# EasyEDA schematic SCH_抬升电路.json
TITLE: 抬升电路; REV: 1.0; Date: 2022-10-15; Sheet: 1/1; Drawn By: Banzhuan3721; Company: 垃圾桶
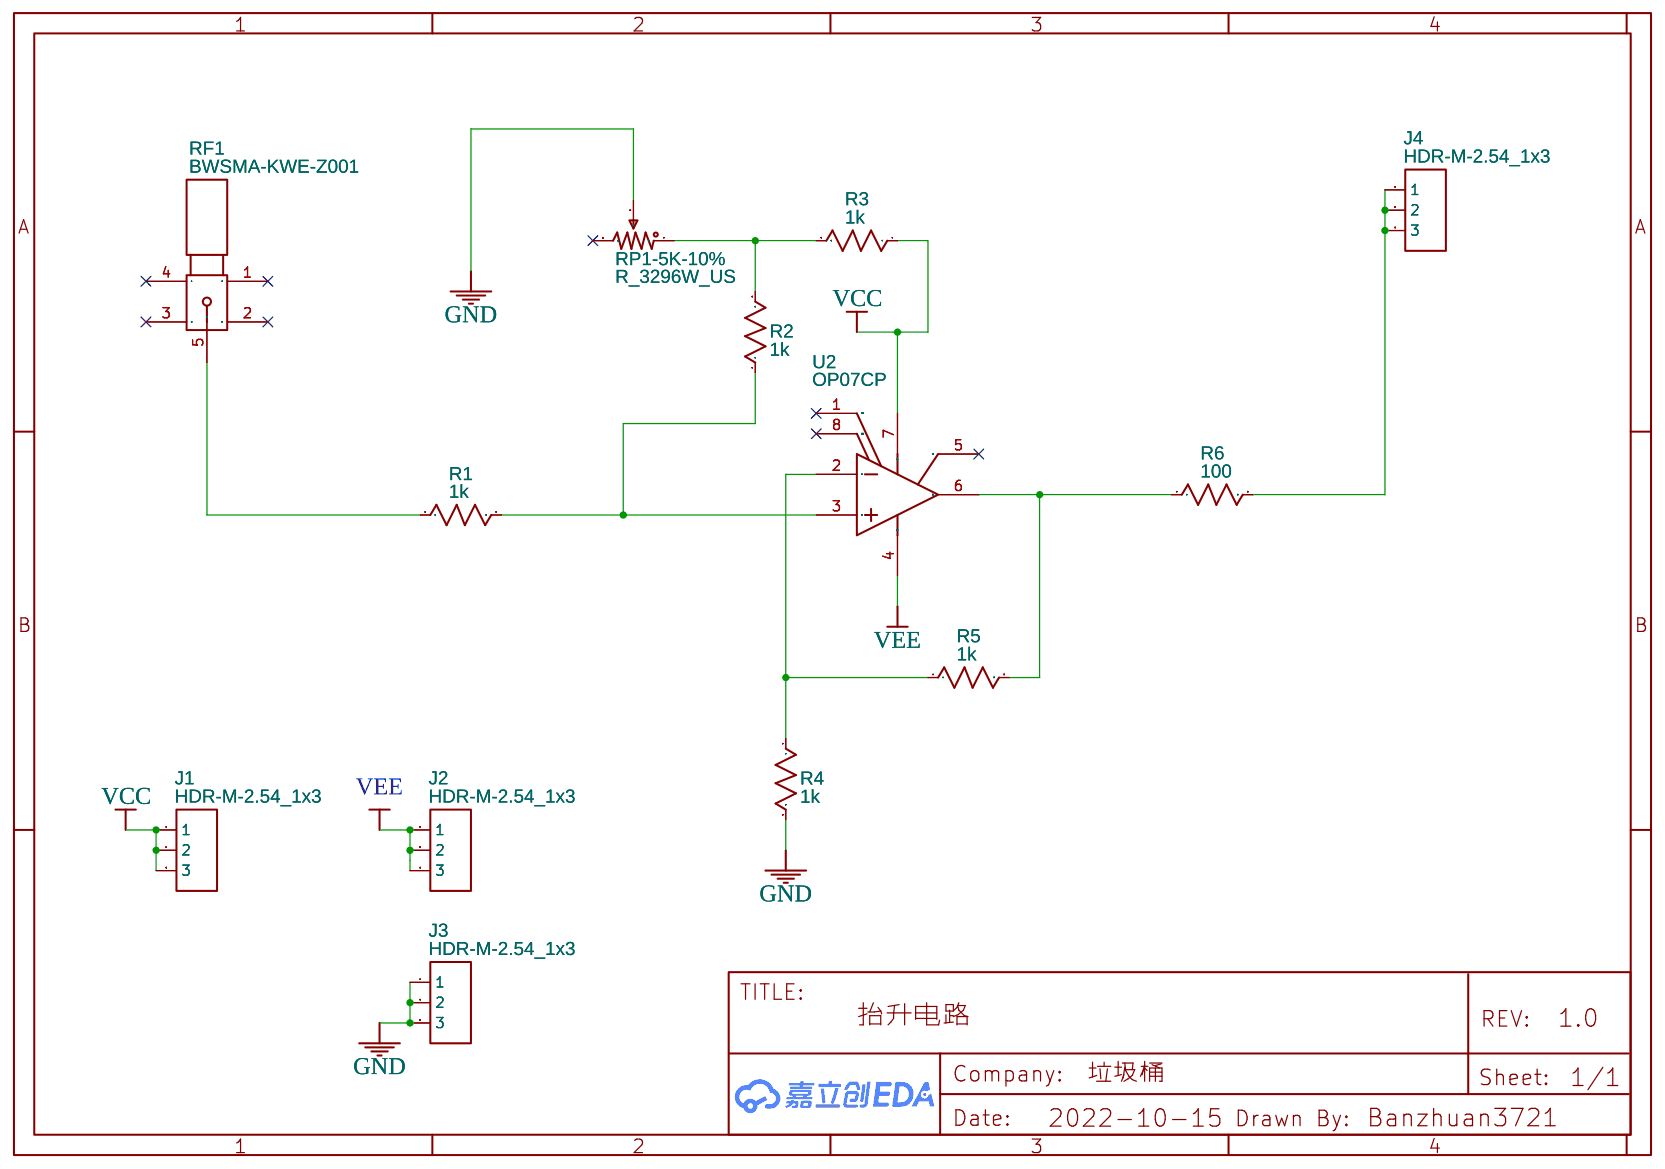
[diagram p0: schematic sheet]

## Parts
J1  HDR-M-2.54_1x3  [HDR-M-2.54_1X3]
J2  HDR-M-2.54_1x3  [HDR-M-2.54_1X3]
J3  HDR-M-2.54_1x3  [HDR-M-2.54_1X3]
J4  HDR-M-2.54_1x3  [HDR-M-2.54_1X3]
R1  1k  [R_AXIAL-0.3]
R2  1k  [R_AXIAL-0.3]
R3  1k  [R_AXIAL-0.3]
R4  1k  [R_AXIAL-0.3]
R5  1k  [R_AXIAL-0.3]
R6  100  [R_AXIAL-0.3]
RF1  BWSMA-KWE-Z001  [SMA-TH_BWSMA-KWE-Z001]
RP1-5K-10%  R_3296W_US  [RES-ADJ-TH_3296W]
U2  OP07CP  [DIP-8_L9.6-W6.4-P2.54-LS7.6-BL-1]

## Library data of the parts
J1-J4 = HDR-M-2.54_1x3: Supplier Part: C180248; Supplier: LCSC; Contributor: LCEDA_Lib
R1-R6 = R_AXIAL-0.3_US: Contributor: LCEDA_Lib
RF1 = BWSMA-KWE-Z001: Supplier: LCSC; Supplier Part: C496551; Manufacturer: BAT WIRELESS; Contributor: LCSC; JLCPCB Part Class: Extended Part
RP1-5K-10% = R_3296W_US: Supplier: LCSC; Contributor: LCEDA_Lib; value(Ω): 10K
U2 = OP07CP: Supplier: LCSC; Manufacturer: TI; Supplier Part: C5224; JLCPCB Part Class: Extended Part

## Nets
GND: J3.1 J3.2 J3.3 R4.2 RP1-5K-10%.2
VCC: J1.1 J1.2 J1.3 R3.1 U2.7(VCC+)
VEE: J2.1 J2.2 J2.3 U2.4(VCC-)
Net-(J4-1): J4.1 J4.2 J4.3 R6.2
Net-(R1-1): R1.1 RF1.5
Net-(R1-2): R1.2 R2.1 U2.3(IN+)
Net-(R2-2): R2.2 R3.2 RP1-5K-10%.1
Net-(R4-1): R4.1 R5.1 U2.2(IN-)
Net-(R5-2): R5.2 R6.1 U2.6(OUT)

Not connected (* = marked no-connect by the designer): RF1 1* 2* 3* 4*; RP1-5K-10% 3*; U2 1(OFFSET_N1)* 5(NC)* 8(OFFSET_N2)*
